# EAGLE design semesterprojekt (EAGLE 8.4.3)
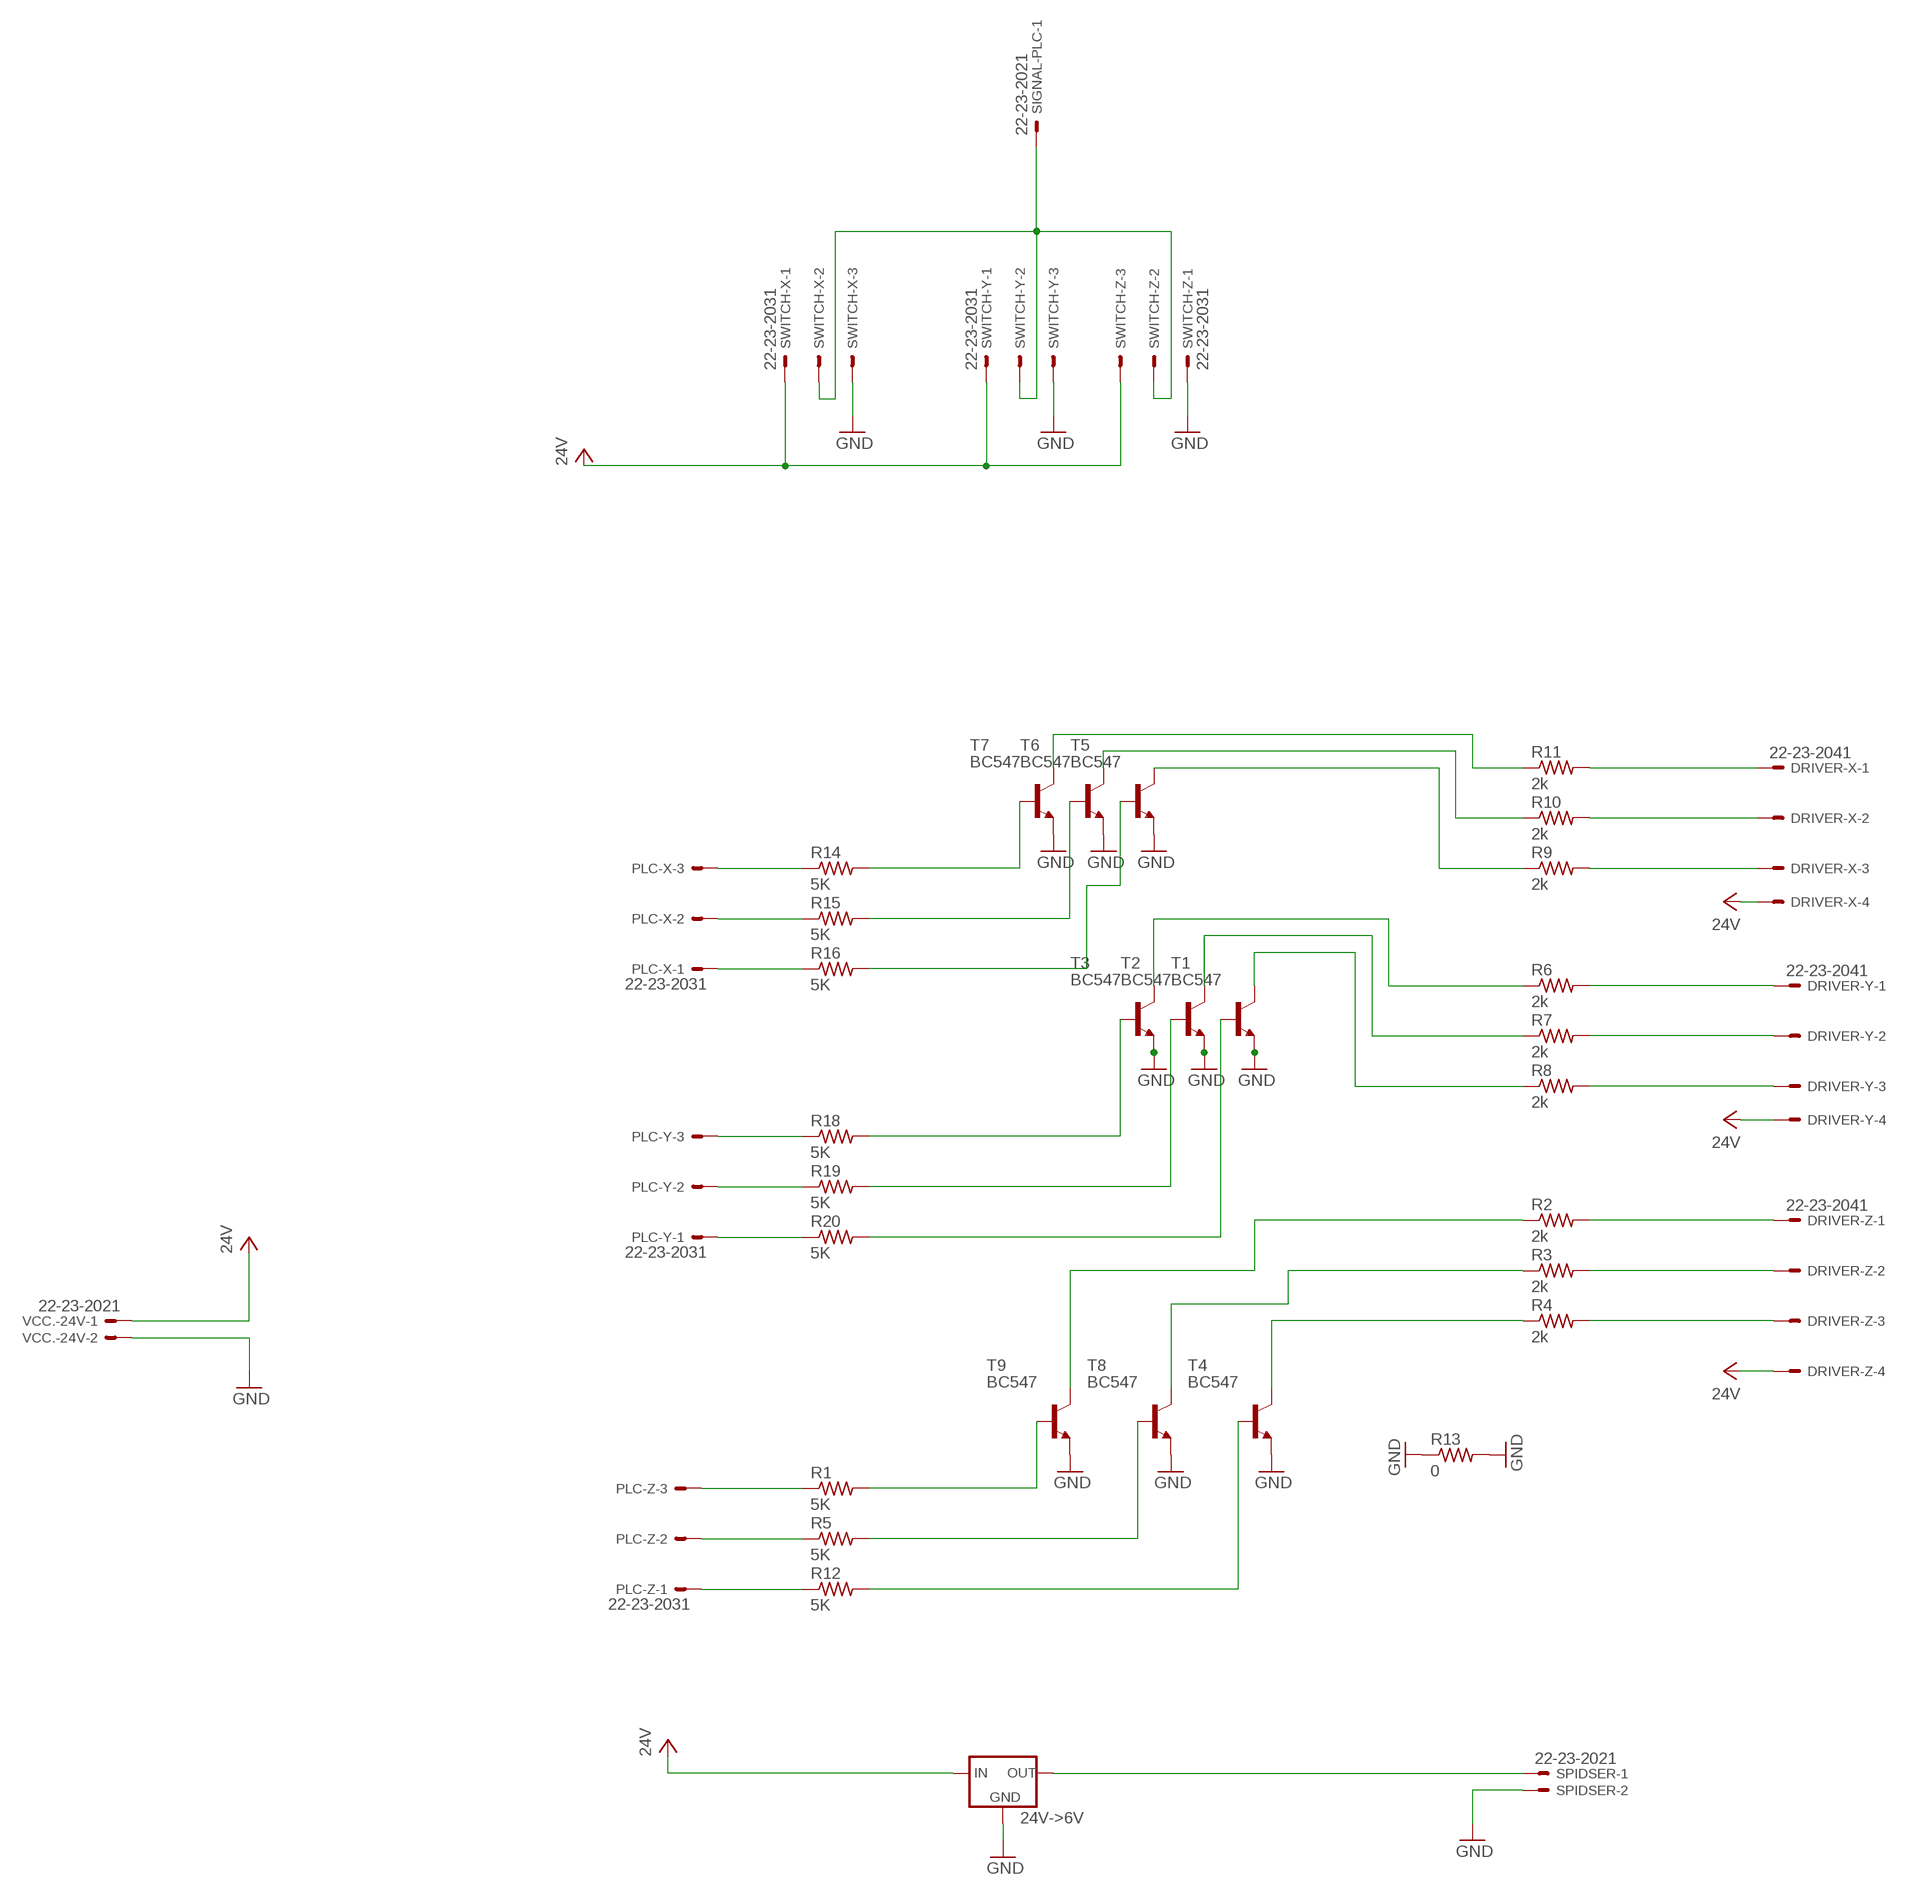
[diagram p0: schematic, sheet 1]

## Parts
24V->6V  78XXS  [78XXS]
DRIVER-X  22-23-2041  [22-23-2041]
DRIVER-Y  22-23-2041  [22-23-2041]
DRIVER-Z  22-23-2041  [22-23-2041]
PLC-X  22-23-2031  [22-23-2031]
PLC-Y  22-23-2031  [22-23-2031]
PLC-Z  22-23-2031  [22-23-2031]
R1  5K  R-US_0204/7  [0204/7]
R2  2k  R-US_0204/7  [0204/7]
R3  2k  R-US_0204/7  [0204/7]
R4  2k  R-US_0204/7  [0204/7]
R5  5K  R-US_0204/7  [0204/7]
R6  2k  R-US_0204/7  [0204/7]
R7  2k  R-US_0204/7  [0204/7]
R8  2k  R-US_0204/7  [0204/7]
R9  2k  R-US_0204/7  [0204/7]
R10  2k  R-US_0204/7  [0204/7]
R11  2k  R-US_0204/7  [0204/7]
R12  5K  R-US_0204/7  [0204/7]
R13  0  R-US_0204/7  [0204/7]
R14  5K  R-US_0204/7  [0204/7]
R15  5K  R-US_0204/7  [0204/7]
R16  5K  R-US_0204/7  [0204/7]
R18  5K  R-US_0204/7  [0204/7]
R19  5K  R-US_0204/7  [0204/7]
R20  5K  R-US_0204/7  [0204/7]
SIGNAL-PLC  22-23-2021  [22-23-2021]
SPIDSER  22-23-2021  [22-23-2021]
SWITCH-X  22-23-2031  [22-23-2031]
SWITCH-Y  22-23-2031  [22-23-2031]
SWITCH-Z  22-23-2031  [22-23-2031]
T1  BC547  2N3565  [TO92]
T2  BC547  2N3565  [TO92]
T3  BC547  2N3565  [TO92]
T4  BC547  2N3565  [TO92]
T5  BC547  2N3565  [TO92]
T6  BC547  2N3565  [TO92]
T7  BC547  2N3565  [TO92]
T8  BC547  2N3565  [TO92]
T9  BC547  2N3565  [TO92]
VCC.-24V  22-23-2021  [22-23-2021]

## Nets
GND: 24V->6V.GND R13.1 R13.2 SPIDSER.2 SWITCH-X.3 SWITCH-Y.3 SWITCH-Z.1 T1.3(E) T2.3(E) T3.3(E) T4.3(E) T5.3(E) T6.3(E) T7.3(E) T8.3(E) T9.3(E) VCC.-24V.2
N$2: DRIVER-Z.1 R2.2
N$3: DRIVER-Z.2 R3.2
N$4: DRIVER-Z.3 R4.2
N$5: 24V->6V.OUT SPIDSER.1
N$6: R14.2 T7.2(B)
N$7: R15.2 T6.2(B)
N$8: R16.2 T5.2(B)
N$9: PLC-X.2 R15.1
N$10: R18.2 T3.2(B)
N$11: R19.2 T2.2(B)
N$12: R20.2 T1.2(B)
N$14: R4.1 T4.1(C)
N$15: PLC-X.1 R16.1
N$16: SIGNAL-PLC.1 SWITCH-X.2 SWITCH-Y.2 SWITCH-Z.2
N$17: PLC-Y.3 R18.1
N$18: R8.1 T1.1(C)
N$19: DRIVER-Y.3 R8.2
N$20: R7.1 T2.1(C)
N$21: DRIVER-Y.2 R7.2
N$22: R6.1 T3.1(C)
N$23: DRIVER-Y.1 R6.2
N$24: PLC-Y.2 R19.1
N$25: R9.1 T5.1(C)
N$26: DRIVER-X.2 R10.2
N$27: R10.1 T6.1(C)
N$28: R11.1 T7.1(C)
N$29: PLC-Y.1 R20.1
N$30: R3.1 T8.1(C)
N$31: DRIVER-X.1 R11.2
N$32: DRIVER-X.3 R9.2
N$33: R2.1 T9.1(C)
N$34: PLC-Z.1 R12.1
N$35: PLC-Z.2 R5.1
N$36: PLC-Z.3 R1.1
N$37: PLC-X.3 R14.1
N$38: R12.2 T4.2(B)
N$39: R5.2 T8.2(B)
N$40: R1.2 T9.2(B)
VCC: 24V->6V.IN DRIVER-X.4 DRIVER-Y.4 DRIVER-Z.4 SWITCH-X.1 SWITCH-Y.1 SWITCH-Z.3 VCC.-24V.1 ; supply symbol labelled 24V
Unconnected: SIGNAL-PLC.2

## Library data of the parts
24V->6V = v-reg:78XXS: VOLTAGE REGULATOR
DRIVER-X DRIVER-Y DRIVER-Z = con-molex:22-23-2041: .100" (2.54mm) Center Header - 4 Pin; MF: MOLEX; MPN: 22-23-2041; OC_FARNELL: 1462920; OC_NEWARK: 38C0355
PLC-X PLC-Y PLC-Z SWITCH-X SWITCH-Y SWITCH-Z = con-molex:22-23-2031: .100" (2.54mm) Center Header - 3 Pin; MF: MOLEX; MPN: 22-23-2031; OC_FARNELL: 1462950; OC_NEWARK: 30C0862
R1-R16 R18-R20 = rcl:R-US_: RESISTOR, American symbol
SIGNAL-PLC SPIDSER VCC.-24V = con-molex:22-23-2021: .100" (2.54mm) Center Header - 2 Pin; MF: MOLEX; MPN: 22-23-2021; OC_FARNELL: 1462926; OC_NEWARK: 25C3832
T1-T9 = transistor:2N3565: NPN TRANSISTOR

## Board
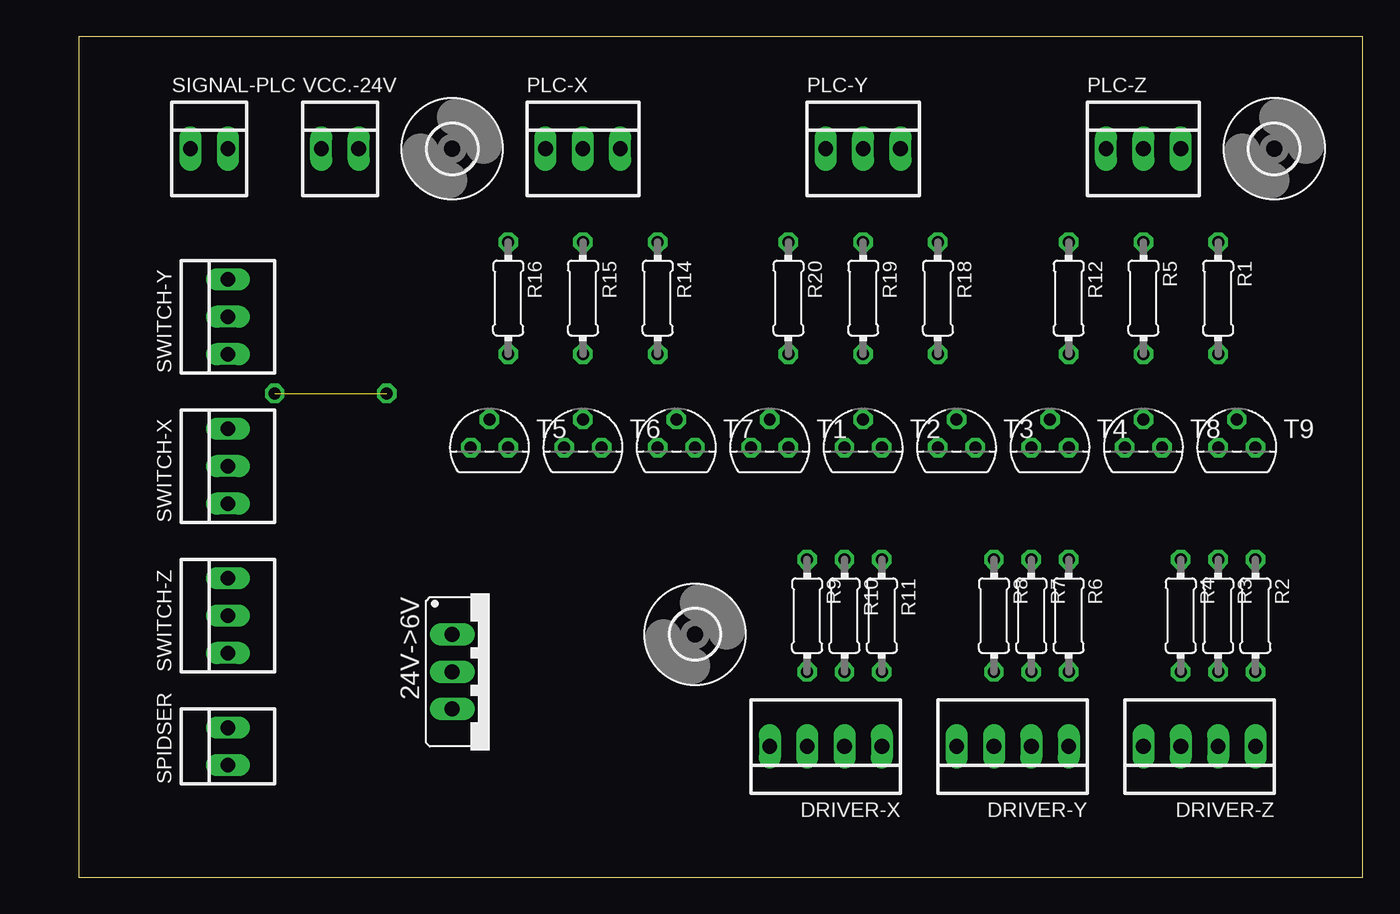
[diagram p1: board, top side]
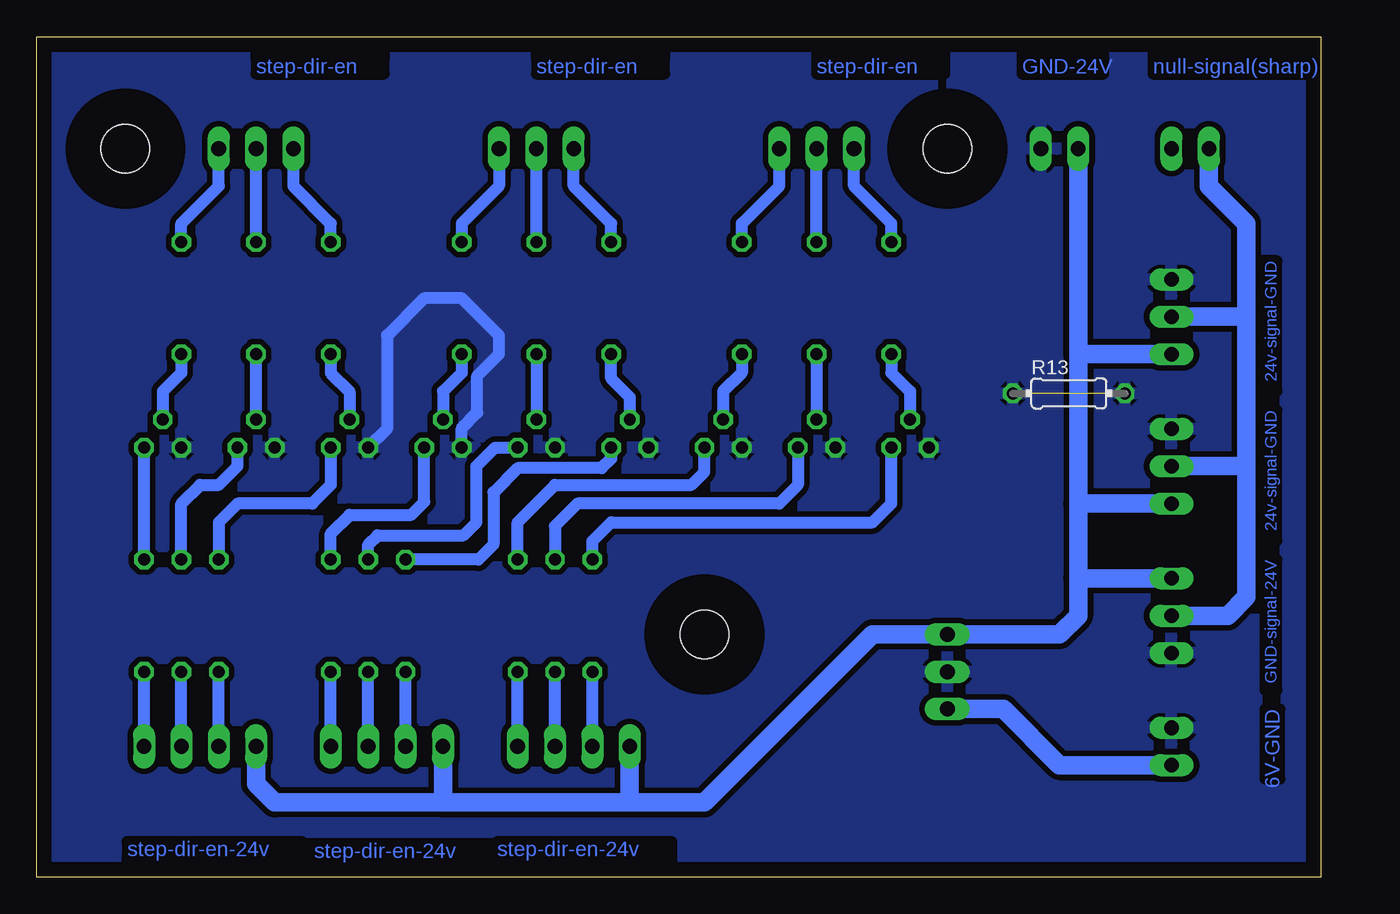
[diagram p2: board, bottom side, seen from below]

Size 87.3 x 57.14 mm. Coordinates in mm from the lower left corner, seen from the top.
Outline: 0,0 87.3,0 87.3,57.14 0,57.14 0,0
Copper layers (1*16): Top 0.035mm / dielectric 1.5mm / Bottom 0.035mm
Design rules "default *": minimum track width 6mil, minimum drill 0.35mm, track to track 15mil, track to pad 15mil, pad to pad 10mil, via to via 10mil, smd to smd 6mil, copper to edge 40mil, drill to drill 6mil, minimum pad ring 10mil, minimum via ring 8mil, stop-mask expansion 4mil, vias tented up to drill 0mil, thermal gap 10mil

### Footprints (pad centres in the part's own frame; a part is rotated, then mirrored left to right if it is on the bottom)
78XXS = drill 1.016 long: GND 0,-2.54; IN -2.54,-2.54; OUT 2.54,-2.54
22-23-2041 = drill 1 long: 1 -3.81,0; 2 -1.27,0; 3 1.27,0; 4 3.81,0
22-23-2031 = drill 1 long: 1 -2.54,0; 2 0,0; 3 2.54,0
0204/7 = drill 0.813 octagon: 1 -3.81,0; 2 3.81,0
22-23-2021 = drill 1 long: 1 -1.27,0; 2 1.27,0
TO92 = drill 0.813 octagon: 1 1.27,0; 2 0,1.905; 3 -1.27,0
3,3 = hole 3.3: 0,0

### Placement (x,y rotation side)
24V->6V  27.94,13.97 270 top
DRIVER-X  50.8,8.89 180 top
DRIVER-Y  63.5,8.89 180 top
DRIVER-Z  76.2,8.89 180 top
PLC-X  34.29,49.53 0 top
PLC-Y  53.34,49.53 0 top
PLC-Z  72.39,49.53 0 top
R1  77.47,39.37 270 top
R2  80.01,17.78 270 top
R3  77.47,17.78 270 top
R4  74.93,17.78 270 top
R5  72.39,39.37 270 top
R6  67.31,17.78 270 top
R7  64.77,17.78 270 top
R8  62.23,17.78 270 top
R9  49.53,17.78 270 top
R10  52.07,17.78 270 top
R11  54.61,17.78 270 top
R12  67.31,39.37 270 top
R13  17.14,32.89 0 bottom
R14  39.37,39.37 270 top
R15  34.29,39.37 270 top
R16  29.21,39.37 270 top
R18  58.42,39.37 270 top
R19  53.34,39.37 270 top
R20  48.26,39.37 270 top
SIGNAL-PLC  8.89,49.53 0 top
SPIDSER  10.16,8.89 90 top
SWITCH-X  10.16,27.94 90 top
SWITCH-Y  10.16,38.1 90 top
SWITCH-Z  10.16,17.78 90 top
T1  46.99,29.21 0 top
T2  53.34,29.21 0 top
T3  59.69,29.21 0 top
T4  66.04,29.21 0 top
T5  27.94,29.21 0 top
T6  34.29,29.21 0 top
T7  40.64,29.21 0 top
T8  72.39,29.21 0 top
T9  78.74,29.21 0 top
U$1  [3,3]  25.4,49.53 0 top
U$2  [3,3]  81.28,49.53 0 top
U$3  [3,3]  41.91,16.51 0 top
VCC.-24V  17.78,49.53 0 top

### Tracks (layer width: path | path; a pad name or v marks a point on that pad's centre or on a via)
GND  (1 unrouted)
  Bottom 0.813: T4.3 63.5,30.48 63.5,36.83 60.96,39.37 58.42,39.37 55.88,36.83 55.88,35.56 57.35,34.09 57.35,31.58 58.42,30.52 T3.3
  pour Bottom: -1.27,-1.27 -1.27,58.42 88.9,58.42 88.9,-1.27
N$2
  Bottom 0.813: DRIVER-Z.1 R2.2
N$3
  Bottom 0.813: DRIVER-Z.2 R3.2
N$4
  Bottom 0.813: DRIVER-Z.3 R4.2
N$5
  Bottom 1.27: 24V->6V.OUT 21.59,11.43 17.78,7.62 SPIDSER.1
N$6
  Bottom 0.813: R14.2 39.37,34.29 40.64,33.02 T7.2
N$7
  Bottom 0.813: R15.2 T6.2
N$8
  Bottom 0.813: R16.2 29.21,34.29 27.94,33.02 T5.2
N$9
  Bottom 0.813: R15.1 PLC-X.2
N$10
  Bottom 0.813: R18.2 58.42,34.29 59.69,33.02 T3.2
N$11
  Bottom 0.813: R19.2 T2.2
N$12
  Bottom 0.813: T1.2 46.99,32.64 48.26,33.91 R20.2
N$14
  Bottom 0.813: T4.1 67.31,26.67 68.58,25.4 73.66,25.4 74.93,24.13 R4.1
N$15
  Bottom 0.813: R16.1 29.21,44.45 31.75,46.99 PLC-X.1
N$16
  Bottom 1.27: SIGNAL-PLC.1 7.62,46.99 5.08,44.45 5.08,38.1 | 5.08,38.1 5.08,27.94 | 5.08,27.94 5.08,19.05 6.35,17.78 SWITCH-Z.2 | SWITCH-X.2 5.08,27.94 | SWITCH-Y.2 5.08,38.1
N$17
  Bottom 0.813: PLC-Y.3 55.88,46.99 58.42,44.45 R18.1
N$18
  Bottom 0.813: T1.1 48.26,28.45 48.89,27.81 54.61,27.81 56.26,26.16 56.26,22.61 57.28,21.59 R8.1
N$19
  Bottom 0.813: DRIVER-Y.3 R8.2
N$20
  Bottom 0.813: R7.1 64.77,22.61 64.14,23.24 58.29,23.24 57.4,24.13 57.4,27.94 56.13,29.21 T2.1
N$21
  Bottom 0.813: DRIVER-Y.2 R7.2
N$22
  Bottom 0.813: R6.1 67.31,23.37 66.04,24.64 61.85,24.64 60.96,25.53 T3.1
N$23
  Bottom 0.813: DRIVER-Y.1 R6.2
N$24
  Bottom 0.813: R19.1 PLC-Y.2
N$25
  Bottom 0.813: R9.1 49.53,22.86 48.26,24.13 30.48,24.13 29.21,25.4 T5.1
N$26
  Bottom 0.813: DRIVER-X.2 R10.2
N$27
  Bottom 0.813: T6.1 35.56,26.67 36.83,25.4 50.55,25.4 52.07,23.88 R10.1
N$28
  Bottom 0.813: R11.1 54.61,24.13 52.07,26.67 42.8,26.67 41.91,27.56 T7.1
N$29
  Bottom 0.813: R20.1 48.26,44.45 50.8,46.99 PLC-Y.1
N$30
  Bottom 0.813: R3.1 77.47,25.4 76.2,26.67 74.93,26.67 73.66,27.94 T8.1
N$31
  Bottom 0.813: DRIVER-X.1 R11.2
N$32
  Bottom 0.813: DRIVER-X.3 R9.2
N$33
  Bottom 0.813: R2.1 T9.1
N$34
  Bottom 0.813: R12.1 67.31,44.45 69.85,46.99 PLC-Z.1
N$35
  Bottom 0.813: R5.1 PLC-Z.2
N$36
  Bottom 0.813: R1.1 77.47,44.45 74.93,46.99 PLC-Z.3
N$37
  Bottom 0.813: R14.1 39.37,44.45 36.83,46.99 PLC-X.3
N$38
  Bottom 0.813: R12.2 67.31,34.29 66.04,33.02 T4.2
N$39
  Bottom 0.813: T8.2 R5.2
N$40
  Bottom 0.813: R1.2 77.47,34.29 78.74,33.02 T9.2
VCC
  Bottom 1.27: 16.51,35.56 VCC.-24V.1 | 16.51,35.56 16.51,25.4 | 16.51,20.32 16.51,17.78 17.78,16.51 24V->6V.IN 30.48,16.51 41.91,5.08 46.99,5.08 | 59.69,5.08 46.99,5.08 | 59.69,5.08 71.12,5.08 72.39,6.35 DRIVER-Z.4 | 16.51,25.4 16.51,20.32 | SWITCH-Z.3 16.51,20.32 | SWITCH-X.1 16.51,25.4 | SWITCH-Y.1 16.51,35.56 | DRIVER-X.4 46.99,5.08 | DRIVER-Y.4 59.69,5.08

### Text on the board
Bottom: null-signal(sharp) | GND-24V | step-dir-en | step-dir-en | step-dir-en | 24v-signal-GND | 24v-signal-GND | GND-signal-24V | 6V-GND | step-dir-en-24v | step-dir-en-24v | step-dir-en-24v